# Altium schematic sheet UC_Interface.SchDoc
size A3; SheetNumber: 3; SheetTotal: 5
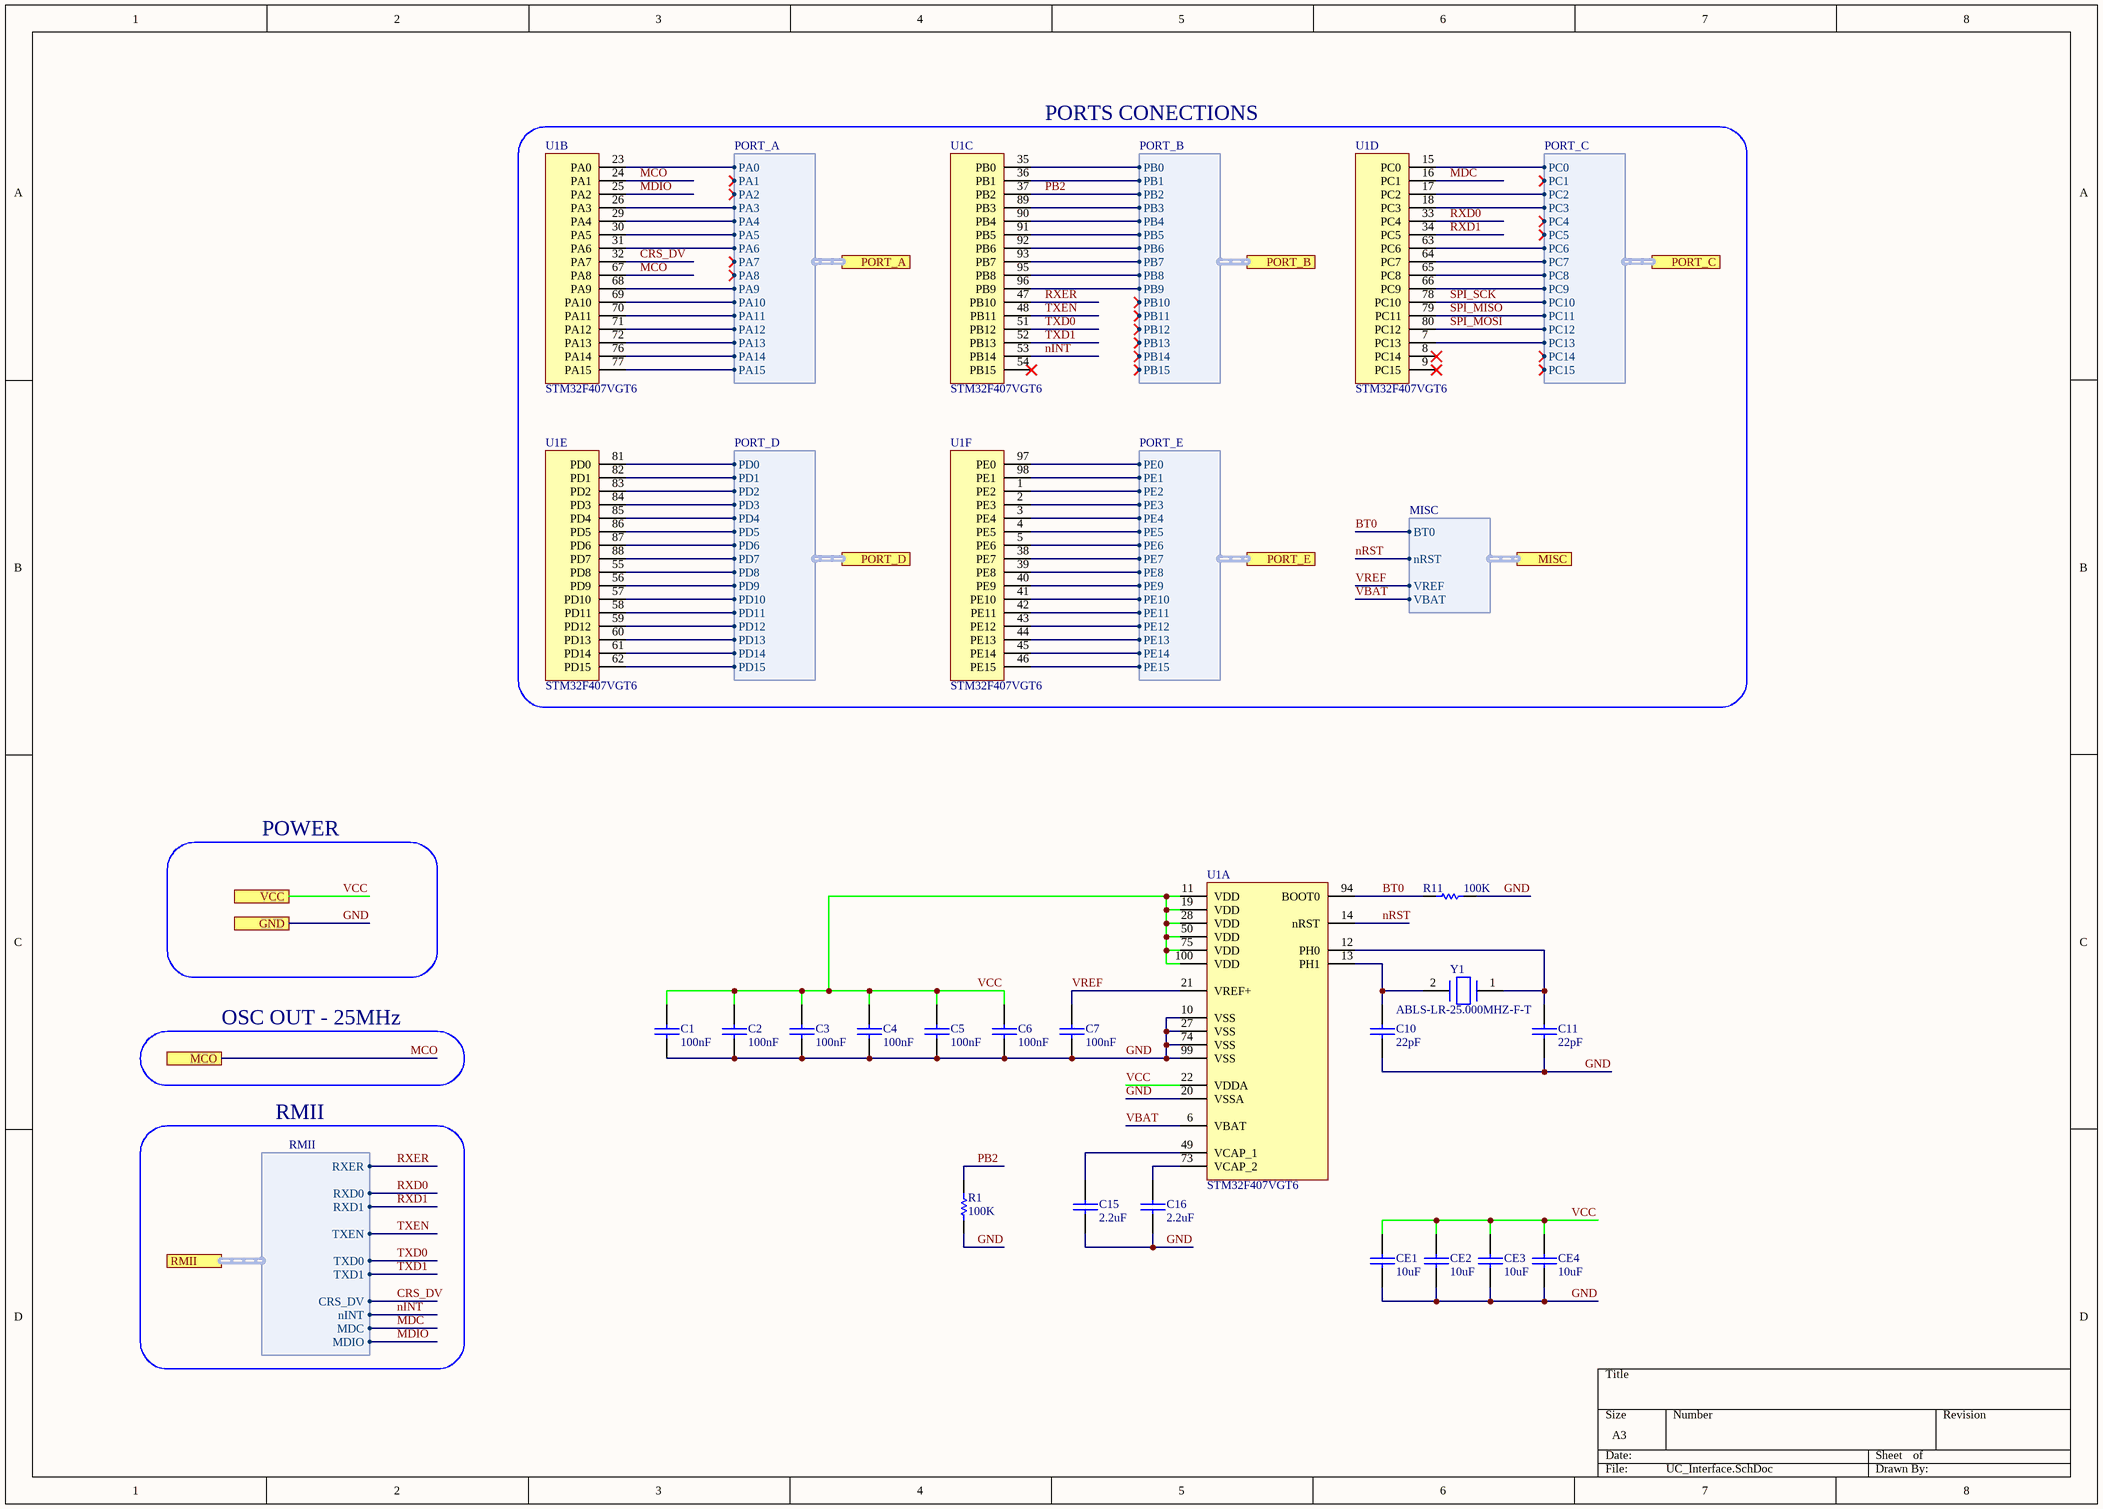
[diagram p0: UC_Interface.SchDoc]

## Parts
C1  100nF  [0402-CAP-TDK]
C2  100nF  [0402-CAP-TDK]
C3  100nF  [0402-CAP-TDK]
C4  100nF  [0402-CAP-TDK]
C5  100nF  [0402-CAP-TDK]
C6  100nF  [0402-CAP-TDK]
C7  100nF  [0402-CAP-TDK]
C10  22pF  [0603-CAP-TDK]
C11  22pF  [0603-CAP-TDK]
C15  2.2uF  [0603-CAP-TDK]
C16  2.2uF  [0603-CAP-TDK]
CE1  10uF  [0805-CAP-TDK]
CE2  10uF  [0805-CAP-TDK]
CE3  10uF  [0805-CAP-TDK]
CE4  10uF  [0805-CAP-TDK]
R1  100K  [0402-RES-PANASONIC]
R11  100K  [0402-RES-PANASONIC]
U1  STM32F407VGT6  [LQFP-100]  (parts A,B,C,D,E,F of 6)
Y1  ABLS-LR-25.000MHZ-F-T  [HC49S]

## Blocks framed on the sheet
PORTS CONECTIONS: U1

## Ports
GND (see MCU_Board_top[2C], ETH_Interface[1C], HDx_Mapping[2D]), MCO (see MCU_Board_top[2B], ETH_Interface[4B]), MISC (harness MISC, see MCU_Board_top[2C], HDx_Mapping[2C]), PORT_A (harness PORT_A, see MCU_Board_top[2B], HDx_Mapping[2A]), PORT_B (harness PORT_B, see MCU_Board_top[2B], HDx_Mapping[4A]), PORT_C (harness PORT_C, see MCU_Board_top[2B], HDx_Mapping[2B]), PORT_D (harness PORT_D, see MCU_Board_top[2B], HDx_Mapping[4B]), PORT_E (harness PORT_E, see MCU_Board_top[2B], HDx_Mapping[4C]), RMII (harness RMII, see MCU_Board_top[2B], ETH_Interface[4C]), VCC (see MCU_Board_top[2B], ETH_Interface[1C], HDx_Mapping[2D])

## Harnesses
PORT_A: PA6, PA7, PA8, PA5, PA9, PA4, PA10, PA3, PA11, PA2, PA1, PA0, PA12, PA13, PA14, PA15
PORT_B: PB6, PB7, PB8, PB5, PB9, PB4, PB10, PB3, PB11, PB2, PB1, PB0, PB12, PB13, PB14, PB15
RMII: MDIO, MDC, nINT, TXD1, TXD0, TXEN, RXD1, RXD0, RXER, CRS_DV
PORT_C: PC6, PC7, PC8, PC5, PC9, PC4, PC10, PC3, PC11, PC2, PC1, PC0, PC12, PC13, PC14, PC15
PORT_D: PD6, PD7, PD8, PD5, PD9, PD4, PD10, PD3, PD11, PD2, PD1, PD0, PD12, PD13, PD14, PD15
PORT_E: PE6, PE7, PE8, PE5, PE9, PE4, PE10, PE3, PE11, PE2, PE1, PE0, PE12, PE13, PE14, PE15
MISC: BT0, nRST, VREF, VBAT

## Nets
BT0: R11.1 U1.94(BOOT0) ; port MISC.BT0
CRS_DV: U1.32(PA7) ; port RMII.CRS_DV
GND: C1.1 C2.1 C3.1 C4.1 C5.1 C6.1 C7.2 C10.1 C11.1 C15.1 C16.1 CE1.1 CE2.1 CE3.1 CE4.1 R1.1 R11.2 U1.10(VSS) U1.20(VSSA) U1.27(VSS) U1.74(VSS) U1.99(VSS) ; port GND
MCO: U1.24(PA1) U1.67(PA8) ; port MCO
MDC: U1.16(PC1) ; port RMII.MDC
MDIO: U1.25(PA2) ; port RMII.MDIO
nINT: U1.53(PB14) ; port RMII.nINT
nRST: U1.14(nRST) ; port MISC.nRST
PB2: R1.2 U1.37(PB2) ; port PORT_B.PB2
RXD0: U1.33(PC4) ; port RMII.RXD0
RXD1: U1.34(PC5) ; port RMII.RXD1
RXER: U1.47(PB10) ; port RMII.RXER
SPI_MISO: U1.79(PC11) ; port PORT_C.PC11
SPI_MOSI: U1.80(PC12) ; port PORT_C.PC12
SPI_SCK: U1.78(PC10) ; port PORT_C.PC10
TXD0: U1.51(PB12) ; port RMII.TXD0
TXD1: U1.52(PB13) ; port RMII.TXD1
TXEN: U1.48(PB11) ; port RMII.TXEN
VBAT: U1.6(VBAT) ; port MISC.VBAT
VCC: C1.2 C2.2 C3.2 C4.2 C5.2 C6.2 CE1.2 CE2.2 CE3.2 CE4.2 U1.11(VDD) U1.19(VDD) U1.22(VDDA) U1.28(VDD) U1.50(VDD) U1.75(VDD) U1.100(VDD) ; port VCC
VREF: C7.1 U1.21(VREF+) ; port MISC.VREF
NetC10_2: C10.2 U1.13(PH1) Y1.2
NetC11_2: C11.2 U1.12(PH0) Y1.1
NetC15_2: C15.2 U1.49(VCAP_1)
NetC16_2: C16.2 U1.73(VCAP_2)
NetU1_1: U1.1(PE2) ; port PORT_E.PE2
NetU1_2: U1.2(PE3) ; port PORT_E.PE3
NetU1_3: U1.3(PE4) ; port PORT_E.PE4
NetU1_4: U1.4(PE5) ; port PORT_E.PE5
NetU1_5: U1.5(PE6) ; port PORT_E.PE6
NetU1_7: U1.7(PC13) ; port PORT_C.PC13
NetU1_15: U1.15(PC0) ; port PORT_C.PC0
NetU1_17: U1.17(PC2) ; port PORT_C.PC2
NetU1_18: U1.18(PC3) ; port PORT_C.PC3
NetU1_23: U1.23(PA0) ; port PORT_A.PA0
NetU1_26: U1.26(PA3) ; port PORT_A.PA3
NetU1_29: U1.29(PA4) ; port PORT_A.PA4
NetU1_30: U1.30(PA5) ; port PORT_A.PA5
NetU1_31: U1.31(PA6) ; port PORT_A.PA6
NetU1_35: U1.35(PB0) ; port PORT_B.PB0
NetU1_36: U1.36(PB1) ; port PORT_B.PB1
NetU1_38: U1.38(PE7) ; port PORT_E.PE7
NetU1_39: U1.39(PE8) ; port PORT_E.PE8
NetU1_40: U1.40(PE9) ; port PORT_E.PE9
NetU1_41: U1.41(PE10) ; port PORT_E.PE10
NetU1_42: U1.42(PE11) ; port PORT_E.PE11
NetU1_43: U1.43(PE12) ; port PORT_E.PE12
NetU1_44: U1.44(PE13) ; port PORT_E.PE13
NetU1_45: U1.45(PE14) ; port PORT_E.PE14
NetU1_46: U1.46(PE15) ; port PORT_E.PE15
NetU1_55: U1.55(PD8) ; port PORT_D.PD8
NetU1_56: U1.56(PD9) ; port PORT_D.PD9
NetU1_57: U1.57(PD10) ; port PORT_D.PD10
NetU1_58: U1.58(PD11) ; port PORT_D.PD11
NetU1_59: U1.59(PD12) ; port PORT_D.PD12
NetU1_60: U1.60(PD13) ; port PORT_D.PD13
NetU1_61: U1.61(PD14) ; port PORT_D.PD14
NetU1_62: U1.62(PD15) ; port PORT_D.PD15
NetU1_63: U1.63(PC6) ; port PORT_C.PC6
NetU1_64: U1.64(PC7) ; port PORT_C.PC7
NetU1_65: U1.65(PC8) ; port PORT_C.PC8
NetU1_66: U1.66(PC9) ; port PORT_C.PC9
NetU1_68: U1.68(PA9) ; port PORT_A.PA9
NetU1_69: U1.69(PA10) ; port PORT_A.PA10
NetU1_70: U1.70(PA11) ; port PORT_A.PA11
NetU1_71: U1.71(PA12) ; port PORT_A.PA12
NetU1_72: U1.72(PA13) ; port PORT_A.PA13
NetU1_76: U1.76(PA14) ; port PORT_A.PA14
NetU1_77: U1.77(PA15) ; port PORT_A.PA15
NetU1_81: U1.81(PD0) ; port PORT_D.PD0
NetU1_82: U1.82(PD1) ; port PORT_D.PD1
NetU1_83: U1.83(PD2) ; port PORT_D.PD2
NetU1_84: U1.84(PD3) ; port PORT_D.PD3
NetU1_85: U1.85(PD4) ; port PORT_D.PD4
NetU1_86: U1.86(PD5) ; port PORT_D.PD5
NetU1_87: U1.87(PD6) ; port PORT_D.PD6
NetU1_88: U1.88(PD7) ; port PORT_D.PD7
NetU1_89: U1.89(PB3) ; port PORT_B.PB3
NetU1_90: U1.90(PB4) ; port PORT_B.PB4
NetU1_91: U1.91(PB5) ; port PORT_B.PB5
NetU1_92: U1.92(PB6) ; port PORT_B.PB6
NetU1_93: U1.93(PB7) ; port PORT_B.PB7
NetU1_95: U1.95(PB8) ; port PORT_B.PB8
NetU1_96: U1.96(PB9) ; port PORT_B.PB9
NetU1_97: U1.97(PE0) ; port PORT_E.PE0
NetU1_98: U1.98(PE1) ; port PORT_E.PE1

Not connected (* = marked no-connect by the designer): U1 8(PC14)* 9(PC15)* 54(PB15)*

## Notes on the sheet
- POWER
- OSC OUT - 25MHz
- RMII

## Library data of the parts
C1-C7 C10 C11 C15 C16 CE1-CE4 = CAP-SMD
R1 R11 = RES-SMD
Y1 = 25.000MHz Crystal